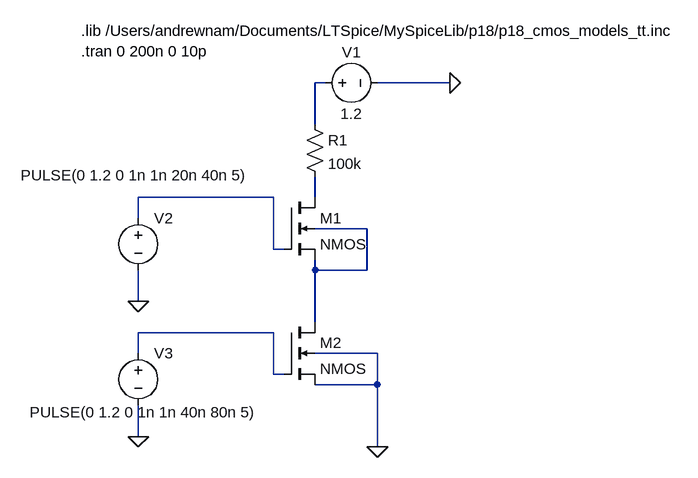
[diagram p0: schematic fig05_nand.asc]
fig05_nand.asc, the LTspice schematic file:
Version 4
SHEET 1 964 680
WIRE 400 80 384 80
WIRE 592 80 480 80
WIRE 384 144 384 80
WIRE 320 256 112 256
WIRE 384 256 384 224
WIRE 112 288 112 256
WIRE 464 304 384 304
WIRE 320 336 320 256
WIRE 336 336 320 336
WIRE 384 368 384 352
WIRE 464 368 464 304
WIRE 464 368 384 368
WIRE 112 416 112 368
WIRE 384 448 384 368
WIRE 320 464 112 464
WIRE 112 496 112 464
WIRE 480 496 384 496
WIRE 320 528 320 464
WIRE 336 528 320 528
WIRE 480 544 480 496
WIRE 480 544 384 544
WIRE 112 624 112 576
WIRE 480 640 480 544
FLAG 592 80 0
FLAG 480 640 0
FLAG 112 624 0
FLAG 112 416 0
SYMBOL voltage 384 80 R270
WINDOW 0 32 56 VTop 2
WINDOW 3 -32 56 VBottom 2
SYMATTR InstName V1
SYMATTR Value 1.2
SYMBOL voltage 112 272 R0
WINDOW 3 -181 -50 Left 2
SYMATTR InstName V2
SYMATTR Value PULSE(0 1.2 0 1n 1n 20n 40n 5)
SYMBOL voltage 112 480 R0
WINDOW 3 -167 107 Left 2
SYMATTR InstName V3
SYMATTR Value PULSE(0 1.2 0 1n 1n 40n 80n 5)
SYMBOL nmos4 336 256 R0
SYMATTR InstName M1
SYMATTR Value2 l=0.18u w=10u
SYMBOL nmos4 336 448 R0
SYMATTR InstName M2
SYMATTR Value2 l=0.18u w=10u
SYMBOL res 368 128 R0
SYMATTR InstName R1
SYMATTR Value 100k
TEXT 24 0 Left 2 !.lib /Users/andrewnam/Documents/LTSpice/MySpiceLib/p18/p18_cmos_models_tt.inc\n.tran 0 200n 0 10p

The netlist it stands for:
* fig05_nand.asc
V1 N001 0 1.2
V2 N002 0 PULSE(0 1.2 0 1n 1n 20n 40n 5)
V3 N005 0 PULSE(0 1.2 0 1n 1n 40n 80n 5)
M1 N003 N002 N004 N004 NMOS l=0.18u w=10u
M2 N004 N005 0 0 NMOS l=0.18u w=10u
R1 N001 N003 100k
.model NMOS NMOS
.model PMOS PMOS
.lib standard.mos
.lib /Users/andrewnam/Documents/LTSpice/MySpiceLib/p18/p18_cmos_models_tt.inc
.tran 0 200n 0 10p
.backanno
.end